# Altium schematic sheet Master.SchDoc: Top-Level Sheet
size Letter; Revision: 1.0; SheetNumber: 2; PageSetup: Record=PageOptions|CenterHorizontal=True|CenterVertical=True|PrintScale=1.00|XCorrection=1.00|YCorrection=1.00|PrintKind=1|BorderSize=5000000|LeftOffset=0|BottomOffset=0|Orientation=2|PaperLength=1000|PaperWidth=1000|Scale=100|PaperSource=7|PrintQuality=-3|MediaType=1|DitherType=10|PrintScaleMode=1|PaperKind=Letter|PaperIndex=1; ProjectTitle: Data Acquisition System
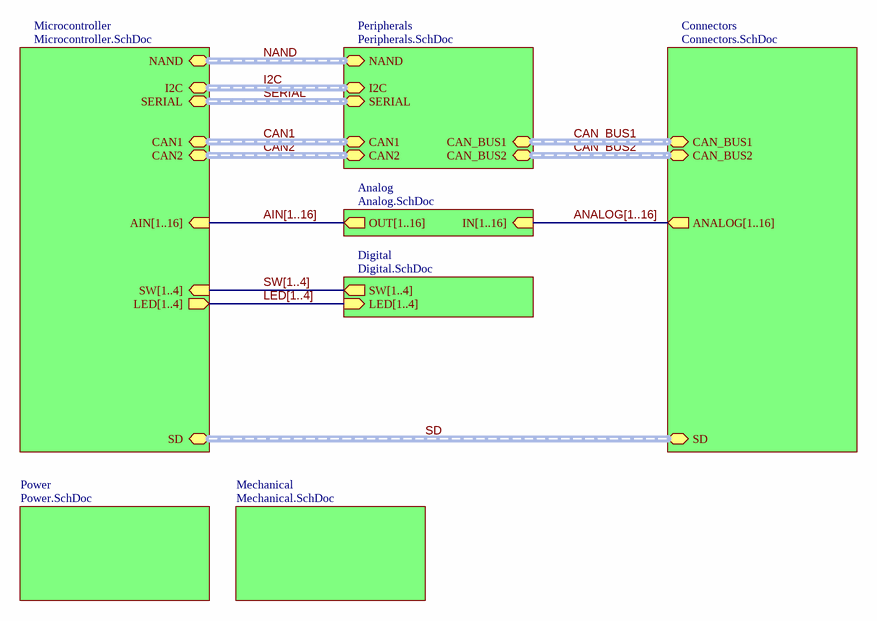
[diagram p0: Master.SchDoc]

## Sub-sheets
Analog = Analog.SchDoc: OUT[1..16] (out), IN[1..16] (in)
Connectors = Connectors.SchDoc: CAN_BUS1 (harness CAN_BUS1), CAN_BUS2 (harness CAN_BUS2), SD (harness SD), ANALOG[1..16] (out)
Digital = Digital.SchDoc: SW[1..4] (out), LED[1..4] (in)
Mechanical = Mechanical.SchDoc: no entries
Microcontroller = Microcontroller.SchDoc: AIN[1..16] (in), SW[1..4] (in), LED[1..4] (out), SD (harness SD), CAN1 (harness CAN1), CAN2 (harness CAN2), NAND (harness NAND), I2C (harness I2C), SERIAL (harness SERIAL)
Peripherals = Peripherals.SchDoc: CAN1 (harness CAN1), CAN2 (harness CAN2), NAND (harness NAND), CAN_BUS1 (harness CAN_BUS1), CAN_BUS2 (harness CAN_BUS2), I2C (harness I2C), SERIAL (harness SERIAL)
Power = Power.SchDoc: no entries

## Buses and harness runs
bus AIN[1..16] = sheet Analog/OUT[1..16] = sheet Microcontroller/AIN[1..16]
bus ANALOG[1..16] = sheet Analog/IN[1..16] = sheet Connectors/ANALOG[1..16]
bus LED[1..4] = sheet Digital/LED[1..4] = sheet Microcontroller/LED[1..4]
bus SW[1..4] = sheet Digital/SW[1..4] = sheet Microcontroller/SW[1..4]
harness CAN1 = sheet Microcontroller/CAN1 = sheet Peripherals/CAN1
harness CAN2 = sheet Microcontroller/CAN2 = sheet Peripherals/CAN2
harness CAN_BUS1 = sheet Connectors/CAN_BUS1 = sheet Peripherals/CAN_BUS1
harness CAN_BUS2 = sheet Connectors/CAN_BUS2 = sheet Peripherals/CAN_BUS2
harness I2C = sheet Microcontroller/I2C = sheet Peripherals/I2C
harness NAND = sheet Microcontroller/NAND = sheet Peripherals/NAND
harness SD = sheet Connectors/SD = sheet Microcontroller/SD
harness SERIAL = sheet Microcontroller/SERIAL = sheet Peripherals/SERIAL

## Notes on the sheet
- Date:
- Revision:
- Sheet
- of